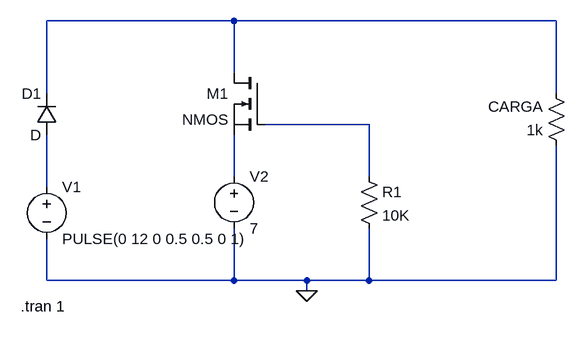
[diagram p0: schematic TP4V2 (1).asc]
TP4V2 (1).asc, the LTspice schematic file:
Version 4.1
SHEET 1 880 680
WIRE 272 -176 -16 -176
WIRE 768 -176 272 -176
WIRE 272 -96 272 -176
WIRE -16 -64 -16 -176
WIRE 768 -64 768 -176
WIRE 480 -16 320 -16
WIRE 272 64 272 0
WIRE 480 64 480 -16
WIRE -16 80 -16 0
WIRE -16 224 -16 160
WIRE 272 224 272 144
WIRE 272 224 -16 224
WIRE 384 224 272 224
WIRE 480 224 480 144
WIRE 480 224 384 224
WIRE 768 224 768 16
WIRE 768 224 480 224
WIRE 384 240 384 224
FLAG 384 240 0
SYMBOL voltage -16 64 R0
WINDOW 123 0 0 Left 0
WINDOW 39 0 0 Left 0
SYMATTR InstName V1
SYMATTR Value PULSE(0 12 0 0.5 0.5 0 1)
SYMBOL diode 0 0 R180
WINDOW 0 24 64 Left 2
WINDOW 3 24 0 Left 2
SYMATTR InstName D1
SYMBOL nmos 320 -96 M0
SYMATTR InstName M1
SYMBOL res 464 48 R0
SYMATTR InstName R1
SYMATTR Value 10K
SYMBOL res 784 32 R180
WINDOW 0 36 76 Left 2
WINDOW 3 36 40 Left 2
SYMATTR InstName CARGA
SYMATTR Value 1k
SYMBOL voltage 272 48 R0
WINDOW 123 0 0 Left 0
WINDOW 39 0 0 Left 0
SYMATTR InstName V2
SYMATTR Value 7
TEXT -56 264 Left 2 !.tran 1

The netlist it stands for:
* TP4V2 (1).asc
V1 N004 0 PULSE(0 12 0 0.5 0.5 0 1)
D1 N004 N001 D
M1 N001 N002 N003 N003 NMOS
R1 N002 0 10K
R§CARGA 0 N001 1k
V2 N003 0 7
.model D D
.lib standard.dio
.model NMOS NMOS
.model PMOS PMOS
.lib standard.mos
.tran 1
.backanno
.end